# Altium schematic sheet main.SchDoc
size A4
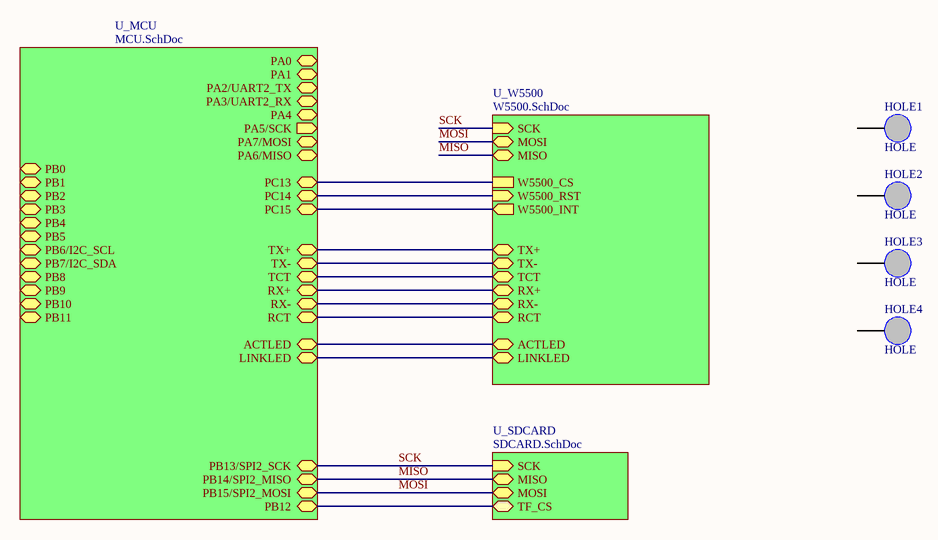
[diagram p0: main.SchDoc]

## Parts
HOLE1  HOLE  [M2.5]
HOLE2  HOLE  [M2.5]
HOLE3  HOLE  [M2.5]
HOLE4  HOLE  [M2.5]

## Sub-sheets
U_MCU = MCU.SchDoc: PA5/SCK (out), PB0, PB1, PB2, PB3, PB4, PB5, PB6/I2C_SCL, PB7/I2C_SDA, PB8, PB9, PB10, PB11, PB12, PA0, PA1, PA2/UART2_TX, PA3/UART2_RX, PA4, PA7/MOSI, PA6/MISO, LINKLED, PB13/SPI2_SCK, PB14/SPI2_MISO, PB15/SPI2_MOSI, TX-, TX+, RX+, RX-, PC13, PC14, PC15, RCT, TCT, ACTLED
U_SDCARD = SDCARD.SchDoc: TF_CS (bidir), SCK (in), MOSI, MISO
U_W5500 = W5500.SchDoc: W5500_INT (out), W5500_CS, W5500_RST (in), SCK (in), MOSI, MISO, LINKLED, TX-, TX+, RX-, RX+, TCT, RCT, ACTLED

## Nets
MISO: sheet U_MCU/PB14/SPI2_MISO, sheet U_SDCARD/MISO, sheet U_W5500/MISO
MOSI: sheet U_MCU/PB15/SPI2_MOSI, sheet U_SDCARD/MOSI, sheet U_W5500/MOSI
SCK: sheet U_MCU/PB13/SPI2_SCK, sheet U_SDCARD/SCK, sheet U_W5500/SCK
(unnamed): sheet U_MCU/PB12, sheet U_SDCARD/TF_CS
(unnamed): sheet U_MCU/LINKLED, sheet U_W5500/LINKLED
(unnamed): sheet U_MCU/TX-, sheet U_W5500/TX-
(unnamed): sheet U_MCU/TX+, sheet U_W5500/TX+
(unnamed): sheet U_MCU/RX+, sheet U_W5500/RX+
(unnamed): sheet U_MCU/RX-, sheet U_W5500/RX-
(unnamed): sheet U_MCU/PC13, sheet U_W5500/W5500_CS
(unnamed): sheet U_MCU/PC14, sheet U_W5500/W5500_RST
(unnamed): sheet U_MCU/PC15, sheet U_W5500/W5500_INT
(unnamed): sheet U_MCU/RCT, sheet U_W5500/RCT
(unnamed): sheet U_MCU/TCT, sheet U_W5500/TCT
(unnamed): sheet U_MCU/ACTLED, sheet U_W5500/ACTLED

Not connected (* = marked no-connect by the designer): HOLE1 0; HOLE2 0; HOLE3 0; HOLE4 0

## Library data of the parts
HOLE1-HOLE4 = HOLE: standard screw